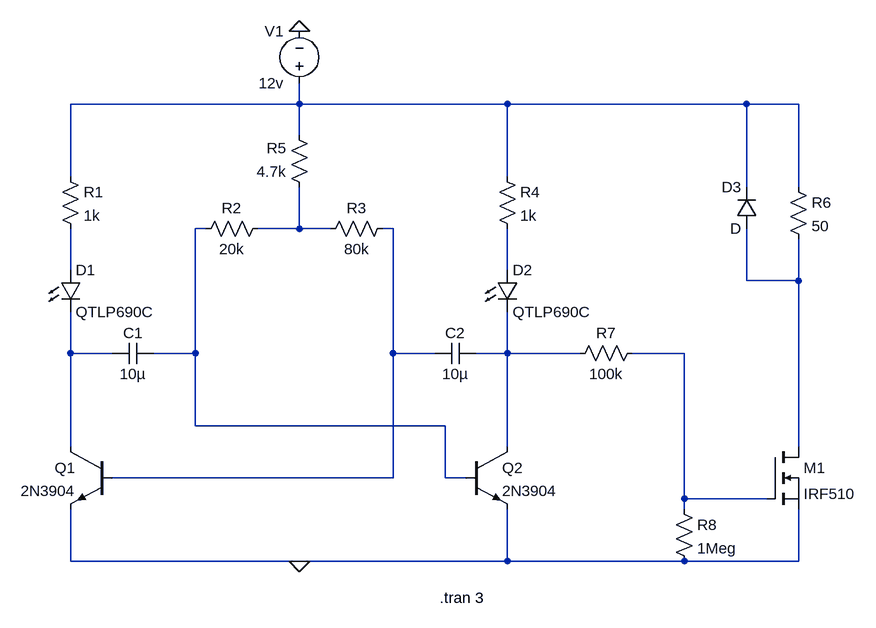
[diagram p0: schematic Astable_Multivibrator_pwm_mosfet.asc]
Astable_Multivibrator_pwm_mosfet.asc, the LTspice schematic file:
Version 4
SHEET 1 1592 824
WIRE 736 48 736 16
WIRE 736 48 384 48
WIRE 1056 48 736 48
WIRE 1424 48 1056 48
WIRE 1504 48 1424 48
WIRE 736 96 736 48
WIRE 384 160 384 48
WIRE 1056 160 1056 48
WIRE 1424 176 1424 48
WIRE 1504 176 1504 48
WIRE 592 240 576 240
WIRE 736 240 736 176
WIRE 736 240 672 240
WIRE 784 240 736 240
WIRE 880 240 864 240
WIRE 384 304 384 240
WIRE 1056 304 1056 240
WIRE 1424 320 1424 240
WIRE 1504 320 1504 256
WIRE 1504 320 1424 320
WIRE 384 432 384 368
WIRE 448 432 384 432
WIRE 576 432 576 240
WIRE 576 432 512 432
WIRE 880 432 880 240
WIRE 944 432 880 432
WIRE 1056 432 1056 368
WIRE 1056 432 1008 432
WIRE 1168 432 1056 432
WIRE 1328 432 1248 432
WIRE 576 544 576 432
WIRE 960 544 576 544
WIRE 384 576 384 432
WIRE 1056 576 1056 432
WIRE 1504 576 1504 320
WIRE 880 624 880 432
WIRE 880 624 448 624
WIRE 960 624 960 544
WIRE 992 624 960 624
WIRE 1328 656 1328 432
WIRE 1456 656 1328 656
WIRE 1328 672 1328 656
WIRE 384 752 384 672
WIRE 736 752 384 752
WIRE 1056 752 1056 672
WIRE 1056 752 736 752
WIRE 1328 752 1056 752
WIRE 1504 752 1504 672
WIRE 1504 752 1328 752
FLAG 736 752 0
FLAG 736 -64 0
SYMBOL Res 368 144 R0
SYMATTR InstName R1
SYMATTR Value 1k
SYMBOL Res 1040 144 R0
SYMATTR InstName R4
SYMATTR Value 1k
SYMBOL Cap 512 416 R90
WINDOW 0 0 32 VBottom 2
WINDOW 3 32 32 VTop 2
SYMATTR InstName C1
SYMATTR Value 10µ
SYMBOL Cap 1008 416 R90
WINDOW 0 0 32 VBottom 2
WINDOW 3 32 32 VTop 2
SYMATTR InstName C2
SYMATTR Value 10µ
SYMBOL npn 992 576 R0
SYMATTR InstName Q2
SYMATTR Value 2N3904
SYMBOL npn 448 576 M0
SYMATTR InstName Q1
SYMATTR Value 2N3904
SYMBOL LED 368 304 R0
SYMATTR InstName D1
SYMATTR Value QTLP690C
SYMBOL LED 1040 304 R0
SYMATTR InstName D2
SYMATTR Value QTLP690C
SYMBOL Voltage 736 32 R180
WINDOW 0 24 96 Left 2
WINDOW 3 24 16 Left 2
SYMATTR InstName V1
SYMATTR Value 12v
SYMBOL Res 688 224 R90
WINDOW 0 0 56 VBottom 2
WINDOW 3 32 56 VTop 2
SYMATTR InstName R2
SYMATTR Value 20k
SYMBOL Res 880 224 R90
WINDOW 0 0 56 VBottom 2
WINDOW 3 32 56 VTop 2
SYMATTR InstName R3
SYMATTR Value 80k
SYMBOL Res 752 192 R180
WINDOW 0 36 76 Left 2
WINDOW 3 36 40 Left 2
SYMATTR InstName R5
SYMATTR Value 4.7k
SYMBOL nmos 1456 576 R0
SYMATTR InstName M1
SYMATTR Value IRF510
SYMBOL Res 1488 160 R0
SYMATTR InstName R6
SYMATTR Value 50
SYMBOL Res 1264 416 R90
WINDOW 0 0 56 VBottom 2
WINDOW 3 32 56 VTop 2
SYMATTR InstName R7
SYMATTR Value 100k
SYMBOL Res 1312 656 R0
SYMATTR InstName R8
SYMATTR Value 1Meg
SYMBOL Diode 1440 240 R180
WINDOW 0 24 64 Left 2
WINDOW 3 24 0 Left 2
SYMATTR InstName D3
TEXT 952 808 Left 2 !.tran 3

The netlist it stands for:
* Astable_Multivibrator_pwm_mosfet.asc
R1 N001 N005 1k
R4 N001 N006 1k
C1 N002 N008 10µ
C2 N009 N004 10µ
Q2 N009 N002 0 0 2N3904
Q1 N008 N004 0 0 2N3904
D1 N005 N008 QTLP690C
D2 N006 N009 QTLP690C
V1 N001 0 12v
R2 N003 N002 20k
R3 N004 N003 80k
R5 N003 N001 4.7k
M1 N007 N010 0 0 IRF510
R6 N001 N007 50
R7 N010 N009 100k
R8 N010 0 1Meg
D3 N007 N001 D
.model D D
.lib standard.dio
.model NPN NPN
.model PNP PNP
.lib standard.bjt
.model NMOS NMOS
.model PMOS PMOS
.lib standard.mos
.tran 3
.backanno
.end